# Altium schematic sheet Sheet1.SchDoc: Altium Handbook
size A4; DrawnBy: Tim Baker; Revision: 1; SheetNumber: 1; SheetTotal: 2
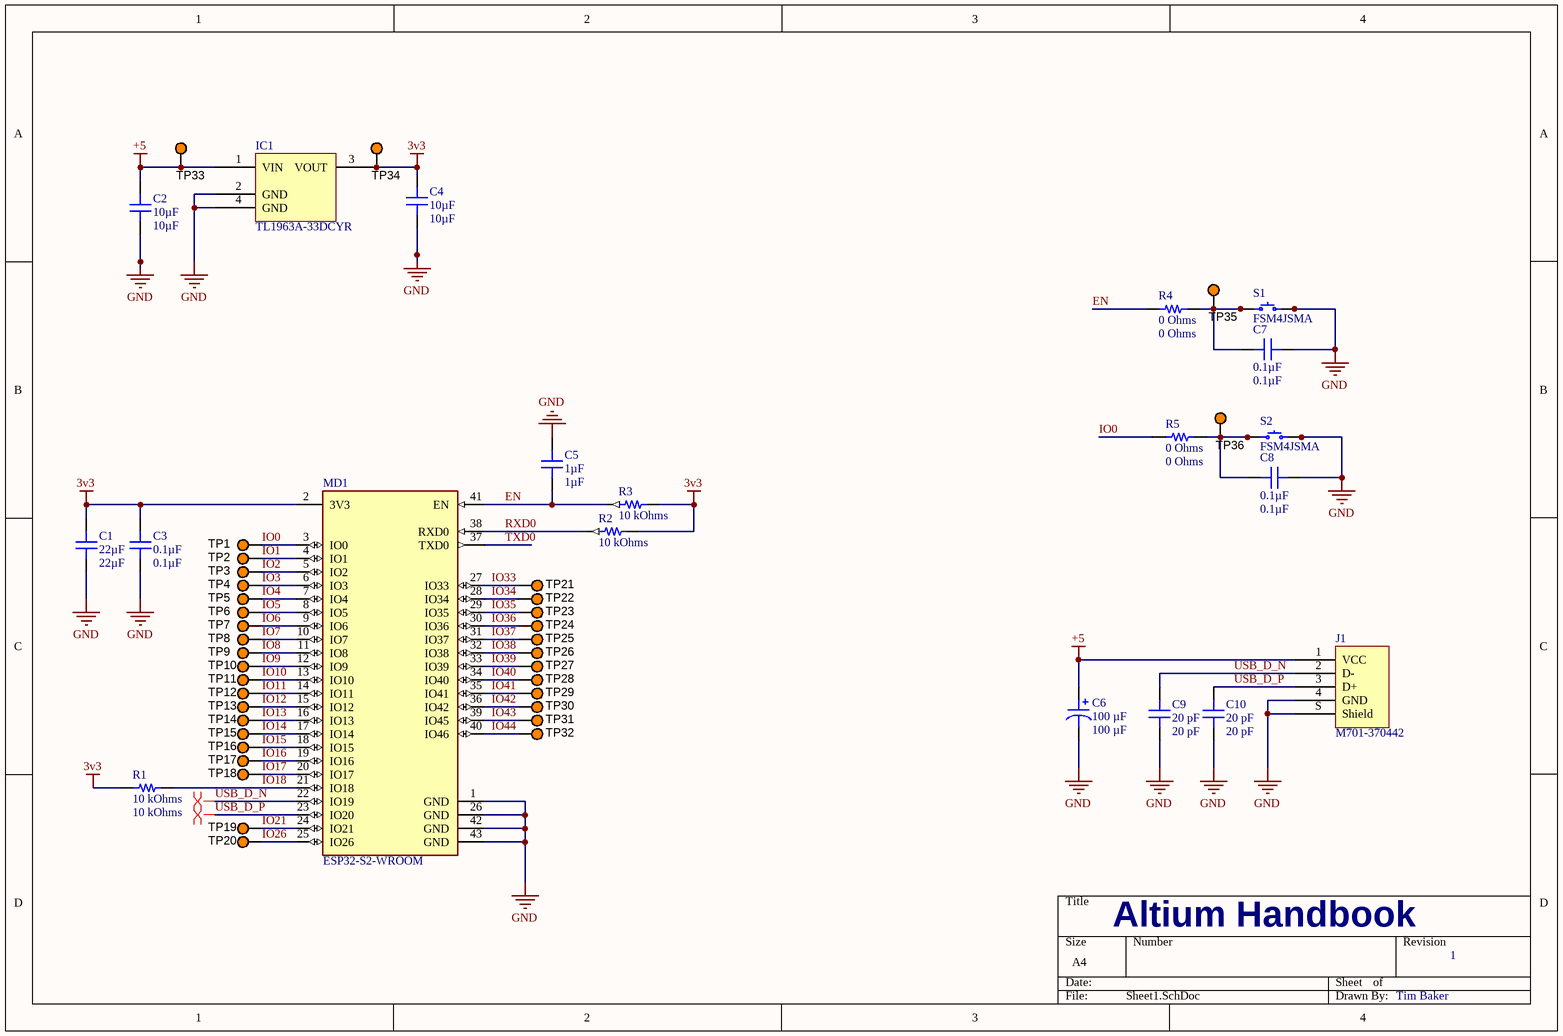
[diagram p0: Sheet1.SchDoc]

## Parts
C1  22µF  [CAP 0805_2012]
C2  10µF  [CAP 0805_2012]
C3  0.1µF  [CAP 0805_2012]
C4  10µF  [CAP 0805_2012]
C5  1µF  [CAP 0805_2012]
C6  100 µF  [CAP POL 2917_7343]
C7  0.1µF  [CAP 0805_2012]
C8  0.1µF  [CAP 0805_2012]
C9  20 pF  [CAP 0805_2012]
C10  20 pF  [CAP 0805_2012]
IC1  TL1963A-33DCYR  [TI SOT-223 DCY]
J1  M701-370442  [HARWIN USB M701-370442]
MD1  ESP32-S2-WROOM  [FP-ESP32-S2-WROOM-MFG]
R1  10 kOhms  [RES 0805_2012]
R2  10 kOhms  [RES 0805_2012]
R3  10 kOhms  [RES 0805_2012]
R4  0 Ohms  [RES 0805_2012]
R5  0 Ohms  [RES 0805_2012]
S1  FSM4JSMA  [TE FSM4JSMA]
S2  FSM4JSMA  [TE FSM4JSMA]
TP1  Test Point Square  [New footprint 1]  (value not drawn)
TP2  Test Point Square  [New footprint 1]  (value not drawn)
TP3  Test Point Square  [New footprint 1]  (value not drawn)
TP4  Test Point Square  [New footprint 1]  (value not drawn)
TP5  Test Point Square  [New footprint 1]  (value not drawn)
TP6  Test Point Square  [New footprint 1]  (value not drawn)
TP7  Test Point Square  [New footprint 1]  (value not drawn)
TP8  Test Point Square  [New footprint 1]  (value not drawn)
TP9  Test Point Square  [New footprint 1]  (value not drawn)
TP10  Test Point Square  [New footprint 1]  (value not drawn)
TP11  Test Point Square  [New footprint 1]  (value not drawn)
TP12  Test Point Square  [New footprint 1]  (value not drawn)
TP13  Test Point Square  [New footprint 1]  (value not drawn)
TP14  Test Point Square  [New footprint 1]  (value not drawn)
TP15  Test Point Square  [New footprint 1]  (value not drawn)
TP16  Test Point Square  [New footprint 1]  (value not drawn)
TP17  Test Point Square  [New footprint 1]  (value not drawn)
TP18  Test Point Square  [New footprint 1]  (value not drawn)
TP19  Test Point Square  [New footprint 1]  (value not drawn)
TP20  Test Point Square  [New footprint 1]  (value not drawn)
TP21  Test Point Square  [New footprint 1]  (value not drawn)
TP22  Test Point Square  [New footprint 1]  (value not drawn)
TP23  Test Point Square  [New footprint 1]  (value not drawn)
TP24  Test Point Square  [New footprint 1]  (value not drawn)
TP25  Test Point Square  [New footprint 1]  (value not drawn)
TP26  Test Point Square  [New footprint 1]  (value not drawn)
TP27  Test Point Square  [New footprint 1]  (value not drawn)
TP28  Test Point Square  [New footprint 1]  (value not drawn)
TP29  Test Point Square  [New footprint 1]  (value not drawn)
TP30  Test Point Square  [New footprint 1]  (value not drawn)
TP31  Test Point Square  [New footprint 1]  (value not drawn)
TP32  Test Point Square  [New footprint 1]  (value not drawn)
TP33  Test Point Square  [New footprint 1]  (value not drawn)
TP34  Test Point Square  [New footprint 1]  (value not drawn)
TP35  Test Point Square  [New footprint 1]  (value not drawn)
TP36  Test Point Square  [New footprint 1]  (value not drawn)

## Nets
3v3: C1.1 C3.2 C4.1 IC1.3(VOUT) MD1.2(3V3) R1.1 R2.2 R3.2 TP34.1
+5: C2.2 C6.1 IC1.1(VIN) J1.1(VCC) TP33.1
GND: C1.2 C2.1 C3.1 C4.2 C5.2 C6.2 C7.1 C8.1 C9.2 C10.1 IC1.2(GND) IC1.4(GND) J1.4(GND) J1.S(Shield) MD1.1(GND) MD1.26(GND) MD1.42(GND) MD1.43(GND) S1.3 S1.4 S2.3 S2.4
EN: C5.1 MD1.41(EN) R3.1 R4.1
IO0: MD1.3(IO0) R5.1 TP1.1
IO1: MD1.4(IO1) TP2.1
IO2: MD1.5(IO2) TP3.1
IO3: MD1.6(IO3) TP4.1
IO4: MD1.7(IO4) TP5.1
IO5: MD1.8(IO5) TP6.1
IO6: MD1.9(IO6) TP7.1
IO7: MD1.10(IO7) TP8.1
IO8: MD1.11(IO8) TP9.1
IO9: MD1.12(IO9) TP10.1
IO10: MD1.13(IO10) TP11.1
IO11: MD1.14(IO11) TP12.1
IO12: MD1.15(IO12) TP13.1
IO13: MD1.16(IO13) TP14.1
IO14: MD1.17(IO14) TP15.1
IO15: MD1.18(IO15) TP16.1
IO16: MD1.19(IO16) TP17.1
IO17: MD1.20(IO17) TP18.1
IO18: MD1.21(IO18) R1.2
IO21: MD1.24(IO21) TP19.1
IO26: MD1.25(IO26) TP20.1
IO33: MD1.27(IO33) TP21.1
IO34: MD1.28(IO34) TP22.1
IO35: MD1.29(IO35) TP23.1
IO36: MD1.30(IO36) TP24.1
IO37: MD1.31(IO37) TP25.1
IO38: MD1.32(IO38) TP26.1
IO39: MD1.33(IO39) TP27.1
IO40: MD1.34(IO40) TP28.1
IO41: MD1.35(IO41) TP29.1
IO42: MD1.36(IO42) TP30.1
IO43: MD1.39(IO45) TP31.1
IO44: MD1.40(IO46) TP32.1
RXD0: MD1.38(RXD0) R2.1
TXD0: MD1.37(TXD0)
USB_D_N: C9.1 J1.2(D-) MD1.22(IO19)
USB_D_P: C10.2 J1.3(D+) MD1.23(IO20)
NetC7_2: C7.2 R4.2 S1.1 S1.2 TP35.1
NetC8_2: C8.2 R5.2 S2.1 S2.2 TP36.1

## Layout directives
differential pair: USB_D_N, USB_D_P

## Library data of the parts
C1 = 0805ZD226MAT2A: CAP CER 22UF 10V X5R 0805; Part Number: 0805ZD226MAT2A; Value: 22µF
C2 C4 = 0805ZD106KAT4A: CAP CER 10UF 10V X5R 0805; Part Number: 0805ZD106KAT4A; Value: 10µF
C3 C7 C8 = 0805ZD104KAT2A: CAP CER 0.1UF 10V X5R 0805; Part Number: 0805ZD104KAT2A; Value: 0.1µF
C5 = 0805ZD105KAT2A: CAP CER 1UF 10V X5R 0805; Part Number: 0805ZD105KAT2A; Value: 1µF
C6 = T491X107K020AT: CAP TANT 100UF 10% 20V 2917; Part Number: T491X107K020AT; Value: 100 µF
C9 C10 = C0805C200G8HAC7800: CAP CER 20PF 10V X8R 0805; Part Number: C0805C200G8HAC7800; Value: 20 pF
IC1 = TL1963A-33DCYR: IC REG LINEAR 3.3V 1.5A SOT223-4; Part Number: TL1963A-33DCYR
J1 = M701-370442: CONN RCPT USB2.0 TYPEB 4P SMD RA; Part Number: M701-370442
MD1 = CMP-194065-000020-1: RX TXRX MOD WIFI SURFACE MOUNT
R1-R3 = SG732ATTD103K: RES 10K OHM 10% 1/8W 0805; Part Number: SG732ATTD103K; Value: 10 kOhms
R4 R5 = CRCW08050000Z0EBC: RES 0 OHM JUMPER 1/8W 0805; Part Number: CRCW08050000Z0EBC; Value: 0 Ohms
S1 S2 = FSM4JSMA: SWITCH TACTILE SPST-NO 0.05A 24V; Part Number: FSM4JSMA
TP1-TP36 = CMP-001-0001-1: 1.5mm Square testpoint